# Altium schematic sheet I2C_EEPROM.SchDoc
size A
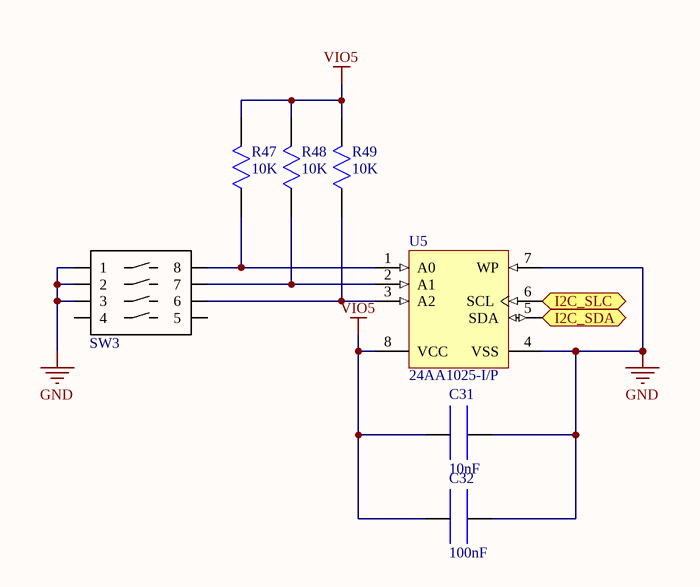
[diagram p0: I2C_EEPROM.SchDoc]

## Parts
C31  value 10nF  [SMD Capacitor 0603]  (hidden comment: Capacitor)
C32  value 100nF  [SMD Capacitor 0603]  (hidden comment: Capacitor)
R47  value 10K  [SMD Resistor 0603]  (hidden comment: Resistor)
R48  value 10K  [SMD Resistor 0603]  (hidden comment: Resistor)
R49  value 10K  [SMD Resistor 0603]  (hidden comment: Resistor)
SW3  SW_DIP_4Position  [218-4LPST]  (value not drawn)
U5  24AA1025-I/P  [PDIP300-P8]

## Ports
I2C_SDA (bidir), I2C_SLC (in)

## Nets
GND: C31.1 C32.1 SW3.1 SW3.2 SW3.3 U5.4(VSS) U5.7(WP)
VIO5: C31.0 C32.0 R47.1 R48.1 R49.1 U5.8(VCC)
I2C_SDA: U5.5(SDA) ; port I2C_SDA
I2C_SLC: U5.6(SCL) ; port I2C_SLC
NetR47_0: R47.0 SW3.8 U5.1(A0)
NetR48_0: R48.0 SW3.7 U5.2(A1)
NetR49_0: R49.0 SW3.6 U5.3(A2)

Not connected (* = marked no-connect by the designer): SW3 4 5

## Library data of the parts
U5 = 24AA1025-I/P: 1 Mbit, 400kHz, 1.7V, I2C Serial EEPROM, 8-Pin PDIP, Industrial Temperature; Manufacturer: Microchip; DatasheetVersion: revF, Oct-2008; PackageVersion: revBB, Aug-2009; PackageReference: PDIP300-P8; PackageDescription: 8-Lead Plastic Dual In-Line (P) - 300 mil Body [PDIP]; Supplier 1: Digi-Key; Supplier Part Number 1: 24AA1025-I/P-ND; Supplier 2: Farnell; Supplier Part Number 2: 1467720; Supplier 3: Newark; Supplier Part Number 3: 56K7661; Supplier 4: Mouser; Supplier Part Number 4: 579-24AA1025-I/P; Mounting Technology: Through Hole; Code_JEDEC: MS-001; PartNumber: 24AA1025-I/P; ComponentLink1Description: Manufacturer URL; ComponentLink1URL: http://www.microchip.com/; ComponentLink2Description: Datasheet; ComponentLink2URL: http://ww1.microchip.com/downloads/en/DeviceDoc/21941F.pdf; ComponentLink3Description: Package Specification; ComponentLink3URL: http://www.microchip.com/stellent/groups/techpub_sg/documents/packagingspec/en012702.pdf